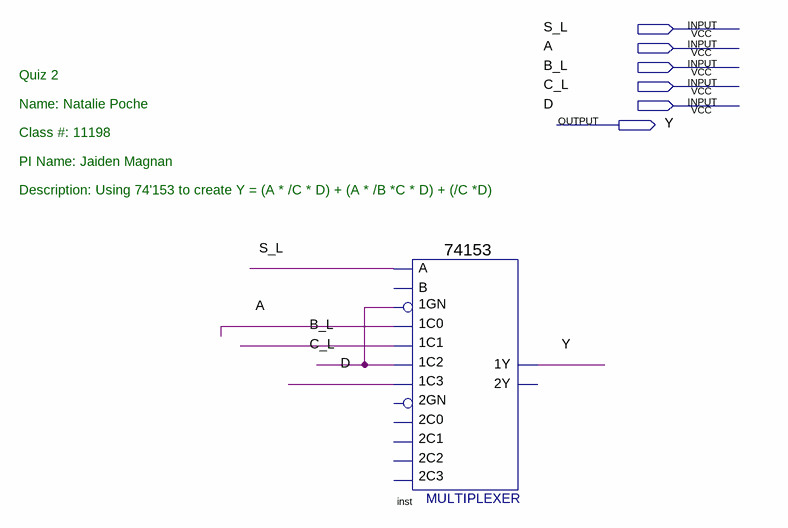
[diagram p0: schematic sheet]
// Quartus schematic quiz2.bdf as structural Verilog: 1 symbols, 6 pins
module quiz2 (
  input  S_L,
  input  A,
  input  B_L,
  input  C_L,
  input  D,
  output Y
);

  \74153  inst (
    .\1C1 (B_L), .\1GN (C_L), .\1C0 (A), .\1C2 (C_L), .\1C3 (D), .A(S_L), .\1Y (Y));  // open: 2C0, 2GN, 2C2, B, 2C1, 2C3, 2Y

  // Notes on the sheet:
  //   Quiz 2
  //   Name: Natalie Poche
  //   Class #: 11198
  //   PI Name: Jaiden Magnan
  //   Description: Using 74'153 to create Y = (A * /C * D) + (A * /B *C * D) + (/C *D)
endmodule
